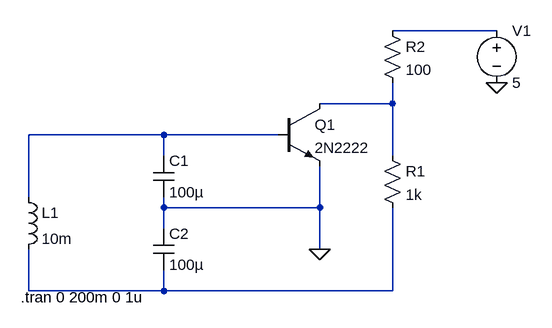
[diagram p0: schematic Colpitts_oscillator_1.asc]
Colpitts_oscillator_1.asc, the LTspice schematic file:
Version 4
SHEET 1 880 680
WIRE 784 -160 624 -160
WIRE 624 -48 624 -80
WIRE 624 -48 512 -48
WIRE 272 0 64 0
WIRE 448 0 272 0
WIRE 272 32 272 0
WIRE 624 32 624 -48
WIRE 64 96 64 0
WIRE 272 112 272 96
WIRE 512 112 512 48
WIRE 512 112 272 112
WIRE 272 144 272 112
WIRE 512 176 512 112
WIRE 64 240 64 176
WIRE 272 240 272 208
WIRE 272 240 64 240
WIRE 624 240 624 112
WIRE 624 240 272 240
FLAG 512 176 0
FLAG 784 -80 0
SYMBOL ind 48 80 R0
SYMATTR InstName L1
SYMATTR Value 10m
SYMBOL cap 256 32 R0
SYMATTR InstName C1
SYMATTR Value 100µ
SYMBOL cap 256 144 R0
SYMATTR InstName C2
SYMATTR Value 100µ
SYMBOL res 608 16 R0
SYMATTR InstName R1
SYMATTR Value 1k
SYMBOL res 608 -176 R0
SYMATTR InstName R2
SYMATTR Value 100
SYMBOL npn 448 -48 R0
SYMATTR InstName Q1
SYMATTR Value 2N2222
SYMBOL voltage 784 -176 R0
WINDOW 123 0 0 Left 0
WINDOW 39 0 0 Left 0
SYMATTR InstName V1
SYMATTR Value 5
TEXT 52 250 Left 2 !.tran 0 200m 0 1u

The netlist it stands for:
* Colpitts_oscillator_1.asc
L1 N003 N004 10m
C1 N003 0 100µ
C2 0 N004 100µ
R1 N002 N004 1k
R2 N001 N002 100
Q1 N002 N003 0 0 2N2222
V1 N001 0 5
.model NPN NPN
.model PNP PNP
.lib standard.bjt
.tran 0 200m 0 1u
.backanno
.end